# EAGLE design IMU9 (EAGLE 6.5.0)
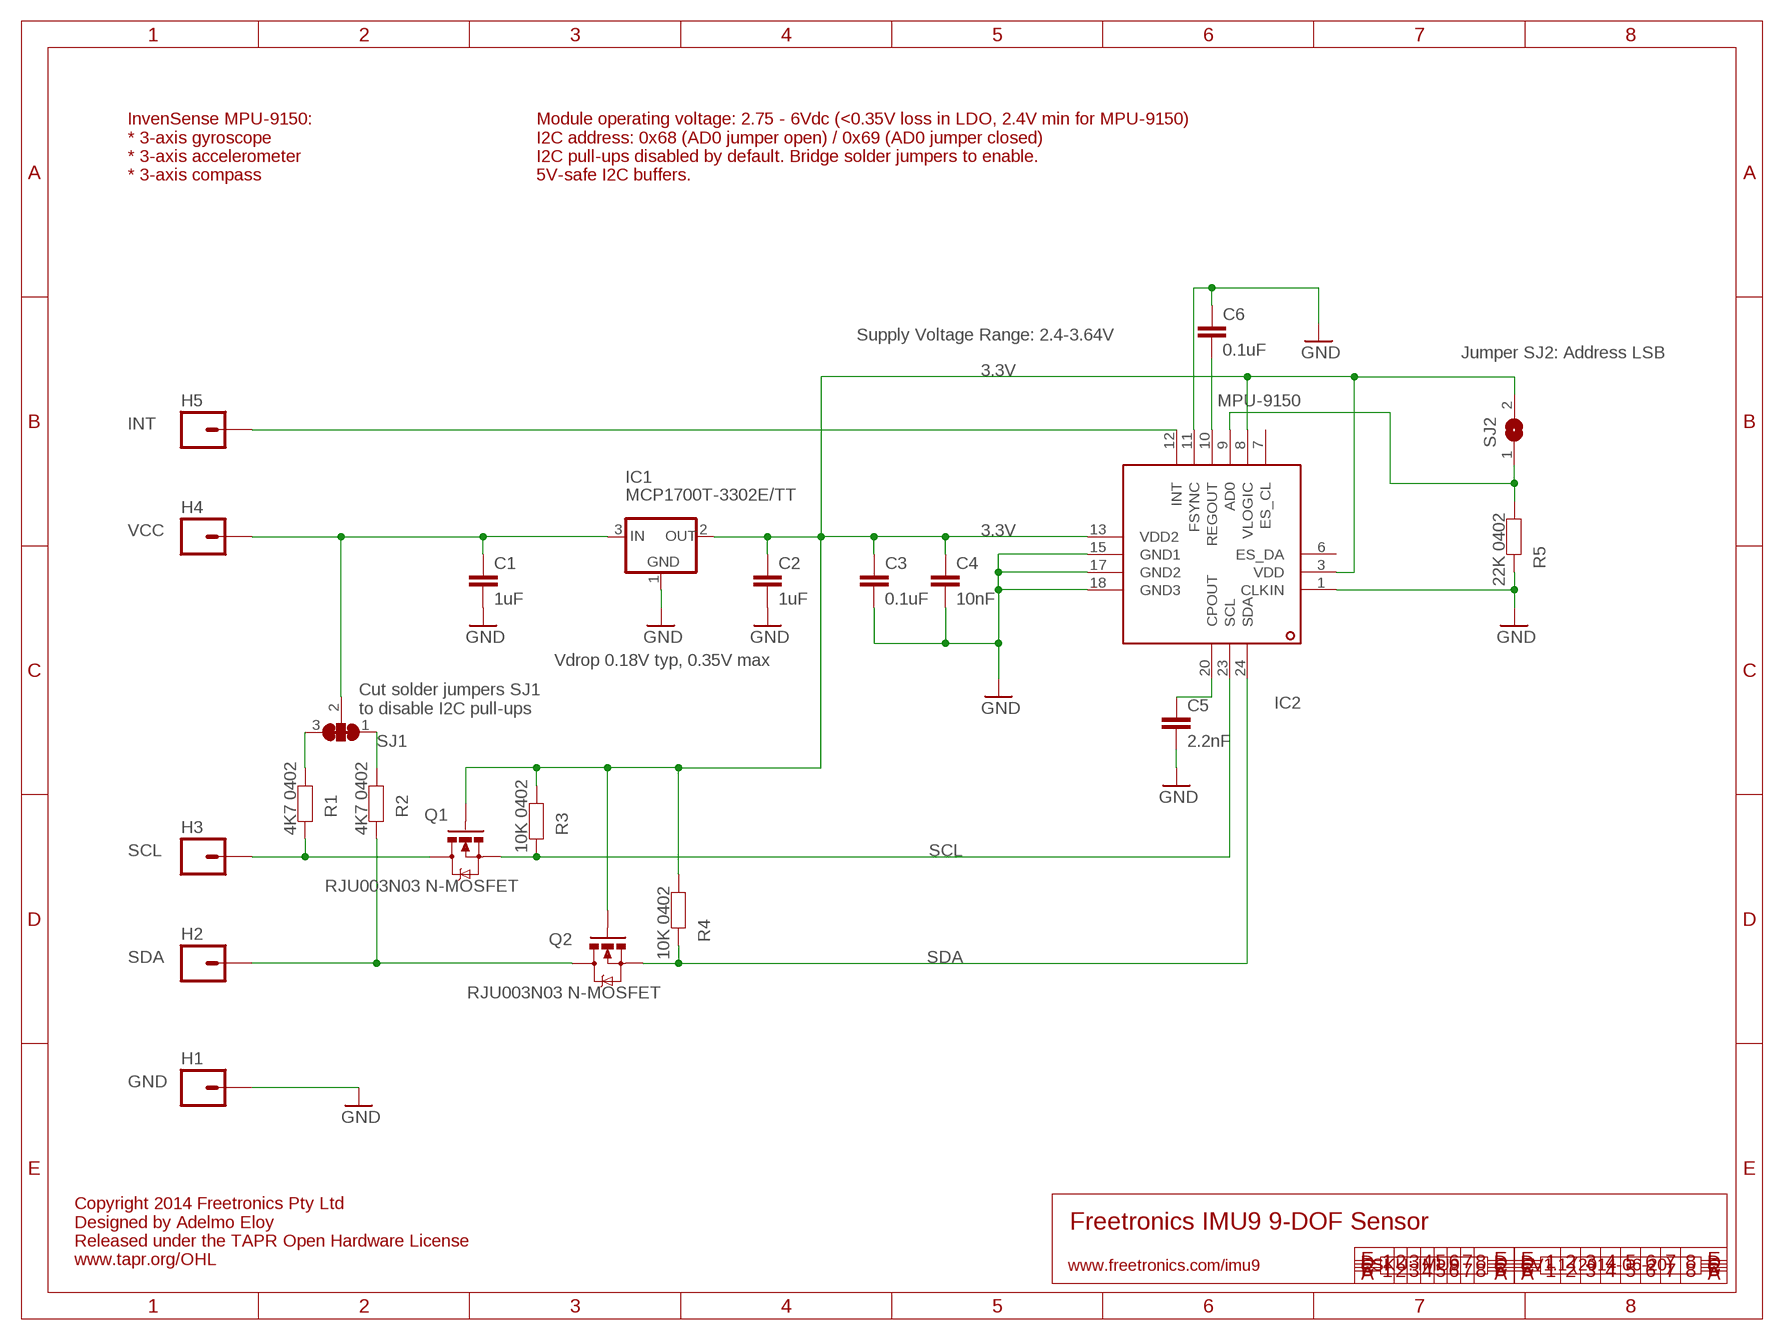
[diagram p0: schematic, sheet 1]

## Parts
C1  1uF  CAP0603  [0603]
C2  1uF  CAP0603  [0603]
C3  0.1uF  CAP0603  [0603]
C4  10nF  CAP0603  [0603]
C5  2.2nF  CAP0603  [0603]
C6  0.1uF  CAP0603  [0603]
H1  GND  M01PTH  [1X01]
H2  SDA  M01PTH  [1X01]
H3  SCL  M01PTH  [1X01]
H4  VCC  M01PTH  [1X01]
H5  INT  M01PTH  [1X01]
IC1  MCP1700T-3302E/TT  V_REG_78XXSOT23-3  [SOT23-3]
IC2  MPU-9150  [QFN-24MPU]
Q1  RJU003N03 N-MOSFET  MOSFET-NSOT-323  [SOT32-3]
Q2  RJU003N03 N-MOSFET  MOSFET-NSOT-323  [SOT32-3]
R1  4K7 0402  RESISTOR0402  [0402]
R2  4K7 0402  RESISTOR0402  [0402]
R3  10K 0402  RESISTOR0402  [0402]
R4  10K 0402  RESISTOR0402  [0402]
R5  22K 0402  RESISTOR0402  [0402]
SJ1  SJ2W  [SJ_2]
SJ2  SJ  [SJ]

## Nets
3.3V: C2.1 C3.1 C4.1 IC1.2(OUT) IC2.3(VDD) IC2.8(VLOGIC) IC2.13(VDD2) Q1.1(G) Q2.1(G) R3.2 R4.2 SJ2.2
GND: C1.2 C2.2 C3.2 C4.2 C5.2 C6.1 H1.1 IC1.1(GND) IC2.1(CLKIN) IC2.11(FSYNC) IC2.15(GND1) IC2.17(GND2) IC2.18(GND3) R5.1
N$1: IC2.23(SCL) Q1.2(S) R3.1
N$2: C5.1 IC2.20(CPOUT)
N$3: C1.1 H4.1 IC1.3(IN) SJ1.2
N$4: IC2.24(SDA) Q2.2(S) R4.1
N$5: R1.2 SJ1.3
N$6: R2.2 SJ1.1
N$7: C6.2 IC2.10(REGOUT)
N$8: IC2.9(AD0) R5.2 SJ2.1
N$14: H5.1 IC2.12(INT)
SCL: H3.1 Q1.3(D) R1.1
SDA: H2.1 Q2.3(D) R2.1
Unconnected: IC2.6(ES_DA) IC2.7(ES_CL)

## Notes on the sheet
- InvenSense MPU-9150:
  * 3-axis gyroscope
  * 3-axis accelerometer
  * 3-axis compass
- Module operating voltage: 2.75 - 6Vdc (<0.35V loss in LDO, 2.4V min for MPU-9150)
  I2C address: 0x68 (AD0 jumper open) / 0x69 (AD0 jumper closed)
  I2C pull-ups disabled by default. Bridge solder jumpers to enable.
  5V-safe I2C buffers.
- Supply Voltage Range: 2.4-3.64V
- Jumper SJ2: Address LSB
- Vdrop 0.18V typ, 0.35V max
- Cut solder jumpers SJ1
  to disable I2C pull-ups
- Freetronics IMU9 9-DOF Sensor
- Copyright 2014 Freetronics Pty Ltd
  Designed by Adelmo Eloy
  Released under the TAPR Open Hardware License
  www.tapr.org/OHL
- www.freetronics.com/imu9 | SKU: IMU9 | V1.1 (2014-06-20)

## Library data of the parts
C1-C6 = freetronics-master-v1:CAP: Capacitor Standard 0603 ceramic capacitor, and 0.1" leaded capacitor.
H1-H5 = freetronics-master-v1.1:M01: Header 1 Standard 1-pin 0.1" header. Use with straight break away headers (SKU : PRT-00116), right angle break away headers (PRT-00553), swiss pins (PRT-00743), machine pins (PRT-00117), and female headers (PRT-00115).
IC1 = freetronics-master-v1:V_REG_78XX
IC2 = freetronics-original:MPU-9150
Q1 Q2 = freetronics-jon:MOSFET-N: Basic N-Channel MOSFET
R1-R5 = freetronics-jon:RESISTOR: Resistor Basic schematic elements and footprints for 0603, 1206, and PTH 1/10th watt (small) resistors.
SJ1 = freetronics-master-v1.1:SJ2W: SMD solder JUMPER
SJ2 = freetronics-master-v1.1:SJ: SMD solder JUMPER

## Board
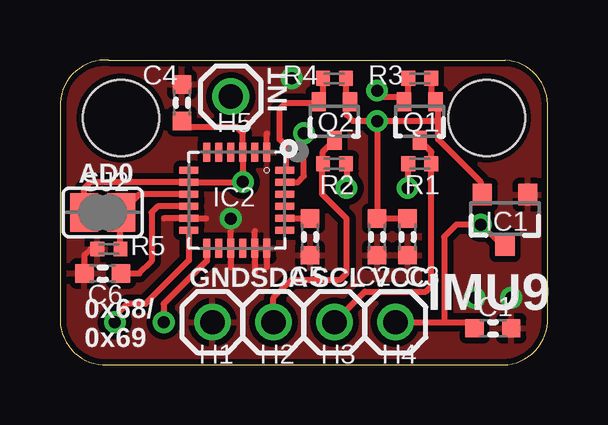
[diagram p1: board, top side]
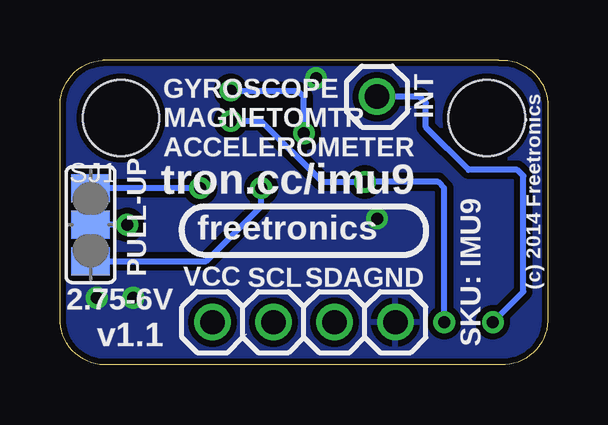
[diagram p2: board, bottom side, seen from below]

Size 20.33 x 12.71 mm. Coordinates in mm from the lower left corner, seen from the top.
Outline: 0,2.04 arc90 1.78,0 18.29,0 arc90 20.32,1.78 20.32,10.67 arc90 18.55,12.7 2.04,12.7 arc90 0,10.93 0,2.04
Copper layers (1*16): Top 0.035mm / dielectric 1.5mm / Bottom 0.035mm
Design rules "default *": minimum track width 8mil, minimum drill 15mil, track to track 10mil, track to pad 10mil, pad to pad 10mil, via to via 10mil, smd to smd 8mil, copper to edge 10mil, drill to drill 8mil, minimum pad ring 10mil, minimum via ring 8mil, stop-mask expansion 4mil, vias tented up to drill 25mil, thermal gap 10mil
Holes 3.17 mm at 17.78,10.29 2.54,10.29

### Footprints (pad centres in the part's own frame; a part is rotated, then mirrored left to right if it is on the bottom)
0603 = smd 0.762 x 0.762: 1 -0.762,0; 2 0.762,0
1X01 = drill 1.016: 1 0,0
SOT23-3 = smd 0.8 x 0.9: 1 -0.95,-1; 2 0.95,-1; 3 0,1.1
QFN-24MPU = smd 0.8 x 0.3: 1 -2,1.25; 2 -2,0.75; 3 -2,0.25; 4 -2,-0.25; 5 -2,-0.75; 6 -2,-1.25; 13 2,-1.25; 14 2,-0.75; 15 2,-0.25; 16 2,0.25; 17 2,0.75; 18 2,1.25 | smd 0.3 x 0.8: 7 -1.25,-2; 8 -0.75,-2; 9 -0.25,-2; 10 0.25,-2; 11 0.75,-2; 12 1.25,-2; 19 1.25,2; 20 0.75,2; 21 0.25,2; 22 -0.25,2; 23 -0.75,2; 24 -1.25,2
SOT32-3 = smd 0.6 x 0.8: 1 -0.65,-0.8; 2 0.65,-0.8; 3 0,0.8
0402 = smd 0.571 x 0.62: 1 -0.48,0; 2 0.48,0
SJ_2 = smd 1.168 x 1.6: 1 -1.524,0; 2 0,0; 3 1.524,0
SJ = smd 1.168 x 1.6: 1 -0.762,0; 2 0.762,0

### Placement (x,y rotation side)
C1  18.04,1.53 0 top
C2  13.21,5.34 270 top
C3  14.48,5.34 270 top
C4  5.08,10.93 90 top
C5  10.42,5.34 270 top
C6  1.78,3.81 0 top
H1  6.35,1.78 270 top
H2  8.89,1.78 270 top
H3  11.43,1.78 270 top
H4  13.97,1.78 270 top
H5  7.12,11.18 90 top
IC1  18.55,6.1 180 top
IC2  7.37,6.86 270 top
Q1  14.99,10.16 180 top
Q2  11.43,10.16 180 top
R1  14.99,8.39 180 top
R2  11.43,8.39 0 top
R3  14.99,11.94 0 top
R4  11.43,11.94 0 top
R5  2.04,4.83 0 top
SJ1  19.05,5.85 90 bottom
SJ2  1.78,6.35 180 top

### Tracks (layer width: path | path; a pad name or v marks a point on that pad's centre or on a via)
3.3V  (via drill 0.5)
  Top 0.254: R3.2 15.47,11.13 Q1.1 15.75,10.85 15.75,10.16 | 15.75,10.16 v13.21,10.16 | 12.2,10.85 Q2.1 | R4.2 11.91,11.13 Q2.1 | C3.1 C2.1 v13.21,10.16 | 15.75,10.16 15.75,9.4 17.53,7.62 17.53,7.17 IC1.2 | SJ2.2 1.02,7.37 1.26,7.61 IC2.8 7.62,7.61 v7.62,7.62 7.62,8.35 IC2.3 7.62,9.66 7.37,9.91 5.08,9.91 C4.1 | IC2.13 6.12,4.34 4.32,2.54 v4.32,1.78 | v13.21,10.16 12.2,10.16 11.94,10.42 11.94,10.82 Q2.1
  Bottom 0.254: v13.21,10.16 11.94,10.16 9.4,7.62 v7.62,7.62 4.58,7.62 4.32,7.37 v4.32,1.78
GND  (via drill 0.5)
  Top 0.254: IC2.1 8.62,9.64 | R5.1 1.27,4.83 1.02,4.58 C6.1 | 6.09,6.11 IC2.11 4.33,6.11 | 7.12,5.59 IC2.15 7.12,4.07 | 8.12,3.83 IC2.17 8.12,5.58 | IC2.18 8.62,4.09
  other vias: 9.66,11.94 7.12,6.1 18.8,2.8 17.28,2.8
  pour Top: 1.63,12.7 18.49,12.7 arc-90 20.32,10.87 20.32,1.83 arc-90 18.49,0 1.71,0 arc-90 0,1.71 0,11.08 arc-90
  pour Bottom: 1.78,12.7 18.36,12.7 arc-91 20.32,10.36 20.32,1.64 arc-89 18.56,0 1.78,0 arc-90 0,1.78 0,10.93 arc-90
N$1  (via drill 0.5)
  Top 0.254: R3.1 14.51,10.96 Q1.2 14.12,11.18 13.47,11.18 v13.21,11.43 | v10.16,9.66 10.16,7.88 9.9,7.61 IC2.23
  Bottom 0.254: v13.21,11.43 10.42,11.43 10.16,11.18 v10.16,9.66
N$2
  Top 0.254: IC2.20 10.43,6.11 C5.1
N$3  (via drill 0.5)
  Top 0.254: H4.1 16.01,1.78 | 18.46,5 IC1.3 18.38,5 v17.53,5.85 16.51,5.85 16.01,5.34 16.01,1.78 | 16.01,1.78 17.02,1.78 C1.1
  Bottom 0.254: v17.53,5.85 SJ1.2
N$4
  Top 0.254: R4.1 10.95,11.13 Q2.2 10.75,10.93 9.4,10.93 9.15,10.67 9.15,9.4 9.4,9.15 9.4,8.14 IC2.24
N$5  (via drill 0.5)
  Top 0.254: R1.2 14.48,8.39 v14.48,7.37
  Bottom 0.254: v14.48,7.37 SJ1.3
N$6  (via drill 0.5)
  Top 0.254: R2.2 11.94,8.39 v11.94,7.37
  Bottom 0.254: SJ1.1 14.23,4.32 11.94,6.61 v11.94,7.37
N$7
  Top 0.254: C6.2 3.31,3.81 3.81,4.32 3.81,6.35 4.07,6.61 IC2.10
N$8
  Top 0.254: R5.2 2.52,6.07 SJ2.1 3.3,7.11 IC2.9
N$13
  Bottom 0.203: 19.05,6.86 19.05,6.35
N$14  (via drill 0.5)
  Top 0.254: IC2.12 5.37,4.35 3.56,2.54 2.8,2.54 2.29,2.04 v2.29,1.78
  Bottom 0.254: v2.29,1.78 1.02,3.05 1.02,7.88 1.27,8.13 3.31,8.13 5.08,9.91 5.08,10.93 5.34,11.18 H5.1
N$15
  Bottom 0.203: 19.05,5.34 19.05,4.83
SCL
  Top 0.254: Q1.3 15.47,8.88 R1.1 | H3.1 12.7,3.05 15.24,3.05 15.47,3.28 R1.1 | 15.5,8.36 R1.1
SDA
  Top 0.254: Q2.3 10.95,8.88 R2.1 10.93,8.36 10.93,7.12 11.94,6.1 11.94,3.81 11.69,3.56 9.66,3.56 8.89,2.8 H2.1

### Text on the board
tPlace: INT | AD0 | GND | SDA | SCL | VCC | IMU9 | 0x68/ / 0x69
bPlace: (c) 2014 Freetronics | INT | GYROSCOPE / MAGNETOMTR / ACCELEROMETER | PULL-UP | tron.cc/imu9 | freetronics | GND | SDA | SCL | VCC | v1.1 | 2.75-6V | SKU: IMU9